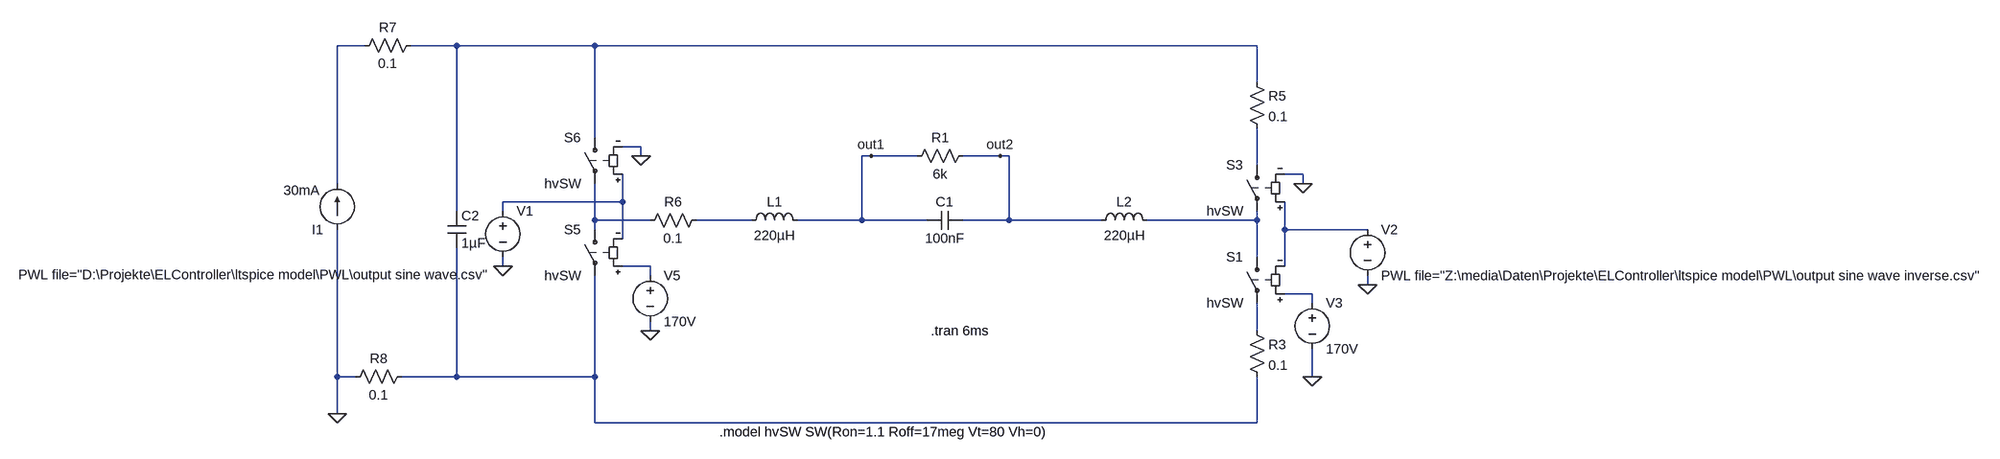
[diagram p0: schematic Filter Test R3.asc]
Filter Test R3.asc, the LTspice schematic file:
Version 4
SHEET 1 2672 680
WIRE -752 -224 -800 -224
WIRE -592 -224 -672 -224
WIRE -352 -224 -592 -224
WIRE 912 -224 -352 -224
WIRE 912 -160 912 -224
WIRE -352 -64 -352 -224
WIRE -272 -48 -304 -48
WIRE -272 -32 -272 -48
WIRE 128 -32 112 -32
WIRE 208 -32 128 -32
WIRE 352 -32 288 -32
WIRE 368 -32 352 -32
WIRE 912 -16 912 -80
WIRE 992 0 960 0
WIRE -800 16 -800 -224
WIRE 992 16 992 0
WIRE -304 48 -304 0
WIRE -304 48 -512 48
WIRE -592 64 -592 -224
WIRE -512 64 -512 48
WIRE -352 80 -352 16
WIRE -256 80 -352 80
WIRE -80 80 -176 80
WIRE 112 80 112 -32
WIRE 112 80 0 80
WIRE 224 80 112 80
WIRE 368 80 368 -32
WIRE 368 80 288 80
WIRE 528 80 368 80
WIRE 912 80 912 64
WIRE 912 80 608 80
WIRE -352 96 -352 80
WIRE 960 96 960 48
WIRE 1104 96 960 96
WIRE -304 112 -304 48
WIRE 912 144 912 80
WIRE -512 160 -512 144
WIRE -256 160 -304 160
WIRE 960 160 960 96
WIRE -256 176 -256 160
WIRE 1104 192 1104 176
WIRE 1008 208 960 208
WIRE 1008 224 1008 208
WIRE -256 272 -256 256
WIRE 912 272 912 224
WIRE -800 352 -800 96
WIRE -768 352 -800 352
WIRE -592 352 -592 128
WIRE -592 352 -688 352
WIRE -352 352 -352 176
WIRE -352 352 -592 352
WIRE 1008 352 1008 304
WIRE -800 416 -800 352
WIRE -352 432 -352 352
WIRE 912 432 912 352
WIRE 912 432 -352 432
FLAG 128 -32 out1
FLAG 352 -32 out2
FLAG 1008 352 0
FLAG 992 16 0
FLAG 1104 192 0
FLAG -800 416 0
FLAG -256 272 0
FLAG -272 -32 0
FLAG -512 160 0
SYMBOL voltage -512 48 R0
WINDOW 123 0 0 Left 0
WINDOW 39 0 0 Left 0
WINDOW 3 -842 127 Left 2
SYMATTR Value PWL file="D:\Projekte\ELController\ltspice model\PWL\output sine wave.csv"
SYMATTR InstName V1
SYMBOL cap 288 64 R90
WINDOW 0 0 32 VBottom 2
WINDOW 3 32 32 VTop 2
SYMATTR InstName C1
SYMATTR Value 100nF
SYMBOL voltage 1104 80 R0
WINDOW 123 0 0 Left 0
WINDOW 39 0 0 Left 0
SYMATTR InstName V2
SYMATTR Value PWL file="Z:\media\Daten\Projekte\ELController\ltspice model\PWL\output sine wave inverse.csv"
SYMBOL ind -96 96 R270
WINDOW 0 32 56 VTop 2
WINDOW 3 5 56 VBottom 2
SYMATTR InstName L1
SYMATTR Value 220µH
SYMBOL ind 512 96 R270
WINDOW 0 32 56 VTop 2
WINDOW 3 5 56 VBottom 2
SYMATTR InstName L2
SYMATTR Value 220µH
SYMBOL res 304 -48 R90
WINDOW 0 0 56 VBottom 2
WINDOW 3 32 56 VTop 2
SYMATTR InstName R1
SYMATTR Value 6k
SYMBOL sw 912 128 M0
SYMATTR InstName S1
SYMATTR Value hvSW
SYMBOL sw 912 -32 M0
SYMATTR InstName S3
SYMATTR Value hvSW
SYMBOL voltage 1008 208 R0
WINDOW 123 0 0 Left 0
WINDOW 39 0 0 Left 0
SYMATTR InstName V3
SYMATTR Value 170V
SYMBOL sw -352 80 M0
SYMATTR InstName S5
SYMATTR Value hvSW
SYMBOL sw -352 -80 M0
SYMATTR InstName S6
SYMATTR Value hvSW
SYMBOL voltage -256 160 R0
WINDOW 123 0 0 Left 0
WINDOW 39 0 0 Left 0
SYMATTR InstName V5
SYMATTR Value 170V
SYMBOL res 896 256 R0
SYMATTR InstName R3
SYMATTR Value 0.1
SYMBOL res 896 -176 R0
SYMATTR InstName R5
SYMATTR Value 0.1
SYMBOL res -160 64 R90
WINDOW 0 0 56 VBottom 2
WINDOW 3 32 56 VTop 2
SYMATTR InstName R6
SYMATTR Value 0.1
SYMBOL cap -608 64 R0
SYMATTR InstName C2
SYMATTR Value 1µF
SYMBOL current -800 96 R180
WINDOW 123 0 0 Left 0
WINDOW 39 0 0 Left 0
WINDOW 3 30 68 Left 2
SYMATTR Value 30mA
SYMATTR InstName I1
SYMBOL res -656 -240 R90
WINDOW 0 0 56 VBottom 2
WINDOW 3 32 56 VTop 2
SYMATTR InstName R7
SYMATTR Value 0.1
SYMBOL res -672 336 R90
WINDOW 0 0 56 VBottom 2
WINDOW 3 32 56 VTop 2
SYMATTR InstName R8
SYMATTR Value 0.1
TEXT 232 272 Left 2 !.tran 6ms
TEXT -136 448 Left 2 !.model hvSW SW(Ron=1.1 Roff=17meg Vt=80 Vh=0)

The netlist it stands for:
* Filter Test R3.asc
V1 N004 0 PWL file="D:\Projekte\ELController\ltspice model\PWL\output sine wave.csv"
C1 out2 out1 100nF
V2 N008 0 PWL file="Z:\media\Daten\Projekte\ELController\ltspice model\PWL\output sine wave inverse.csv"
L1 N006 out1 220µH
L2 out2 N007 220µH
R1 out2 out1 6k
S1 N007 N011 N010 N008 hvSW
S3 N003 N007 N008 0 hvSW
V3 N010 0 170V
S5 N005 N012 N009 N004 hvSW
S6 N002 N005 N004 0 hvSW
V5 N009 0 170V
R3 N011 N012 0.1
R5 N002 N003 0.1
R6 N006 N005 0.1
C2 N002 N012 1µF
I1 0 N001 30mA
R7 N002 N001 0.1
R8 N012 0 0.1
.tran 6ms
.model hvSW SW(Ron=1.1 Roff=17meg Vt=80 Vh=0)
.backanno
.end